# EAGLE schematic toby_little_bits (EAGLE 6.4)
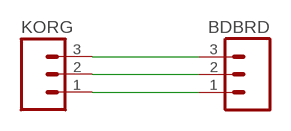
[diagram p0: schematic, sheet 1]

## Parts
BDBRD  M03PTH  [1X03]
KORG  M03SMD  [1X03-1MM-RA]

## Nets
N$1: BDBRD.3 KORG.3
N$2: BDBRD.2 KORG.2
N$3: BDBRD.1 KORG.1

## Library data of the parts
BDBRD KORG = SparkFun:M03: Header 3 Standard 3-pin 0.1" header. Use with straight break away headers (SKU : PRT-00116), right angle break away headers (PRT-00553), swiss pins (PRT-00743), machine pins (PRT-00117), and female headers (PRT-00115). Molex polarized connector foot print use with SKU : PRT-08232 with associated crimp pins and housings.